# EAGLE schematic breadboard_rev08 (EAGLE 6.1)
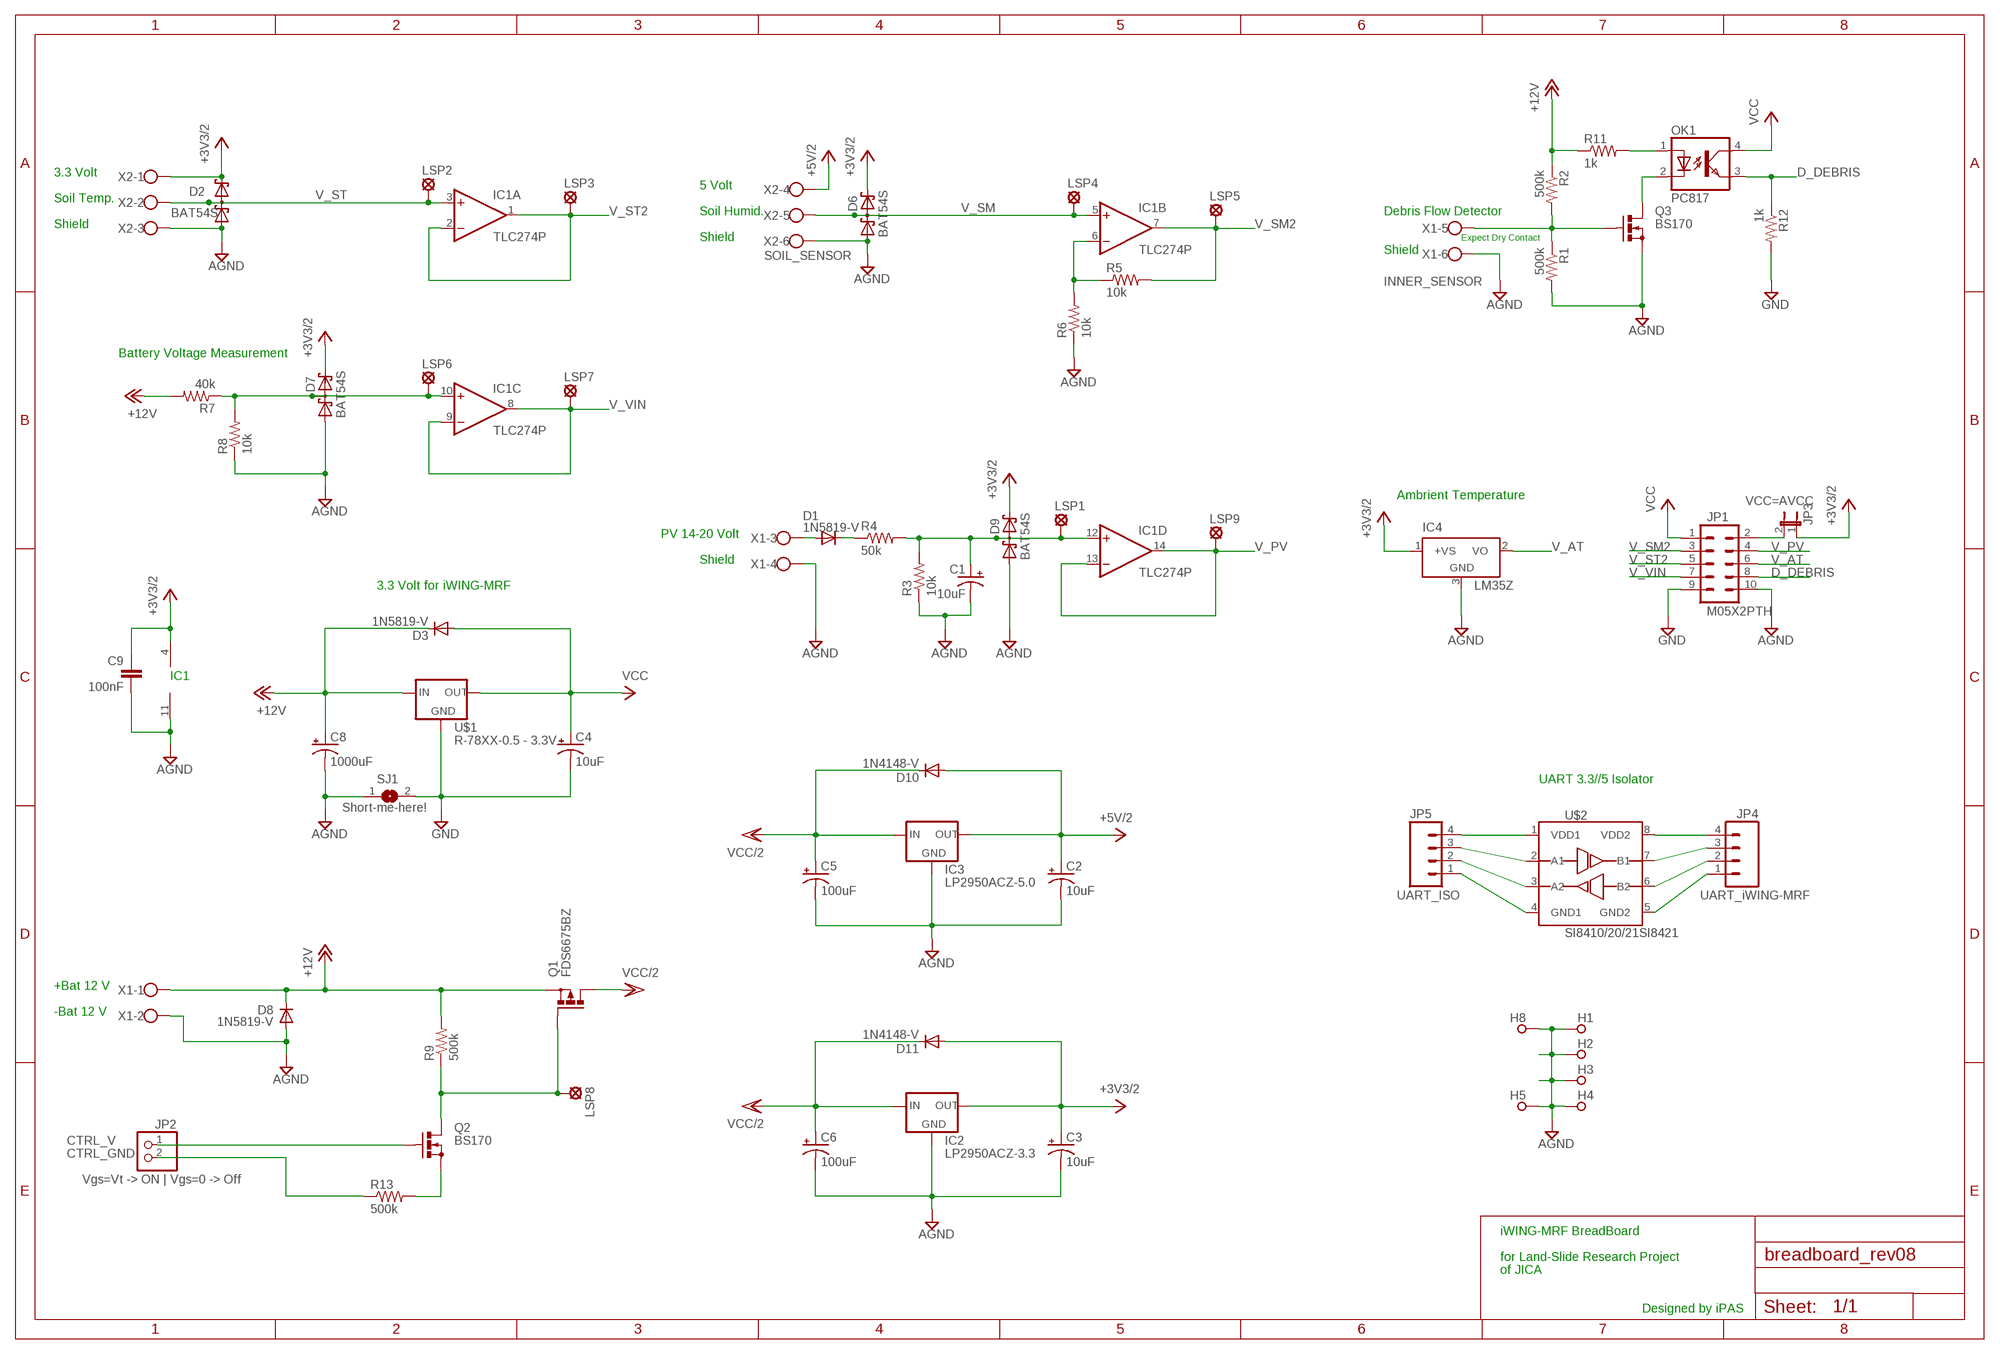
[diagram p0: schematic, sheet 1]

## Parts
C1  10uF  RCL_CPOL-USE2.5-7  [RCL_E2,5-7]
C2  10uF  RCL_CPOL-USE2.5-7  [RCL_E2,5-7]
C3  10uF  RCL_CPOL-USE2.5-7  [RCL_E2,5-7]
C4  10uF  RCL_CPOL-USE2.5-7  [RCL_E2,5-7]
C5  100uF  RCL_CPOL-USE2.5-7  [RCL_E2,5-7]
C6  100uF  RCL_CPOL-USE2.5-7  [RCL_E2,5-7]
C8  1000uF  RCL_CPOL-USE5-13  [RCL_E5-13]
C9  100nF  RCL_C-EU050-025X075  [RCL_C050-025X075]
D1  1N5819-V  [DO41-150V]
D2  BAT54S  [SOT23]
D3  1N5819-V  [DO41-150V]
D6  BAT54S  [SOT23]
D7  BAT54S  [SOT23]
D8  1N5819-V  [DO41-150V]
D9  BAT54S  [SOT23]
D10  1N4148-V  [DO35-100V]
D11  1N4148-V  [DO35-100V]
H1  SPECIAL_DRILL_0.1560  [PAD_0.1560]
H2  SPECIAL_DRILL_0.1560  [PAD_0.1560]
H3  SPECIAL_DRILL_0.1560  [PAD_0.1560]
H4  SPECIAL_DRILL_0.1560  [PAD_0.1560]
H5  SPECIAL_DRILL_0.1560  [PAD_0.1560]
H8  SPECIAL_DRILL_0.1560  [PAD_0.1560]
IC1  TLC274P  [DIL14]
IC2  LP2950ACZ-3.3  [TO92]
IC3  LP2950ACZ-5.0  [TO92]
IC4  LM35Z  [TO92]
JP1  M05X2PTH  [AVR_ICSP]
JP2  Vgs=Vt -> ON | Vgs=0 -> Off  PINHD-1X2  [1X02]
JP3  VCC=AVCC  JP1E  [JUMPER_JP1]
JP4  UART_iWING-MRF  M04POLAR  [MOLEX-1X4]
JP5  UART_ISO  M04POLAR  [MOLEX-1X4]
LSP1  LSP13  [LSP13]
LSP2  LSP13  [LSP13]
LSP3  LSP13  [LSP13]
LSP4  LSP13  [LSP13]
LSP5  LSP13  [LSP13]
LSP6  LSP13  [LSP13]
LSP7  LSP13  [LSP13]
LSP8  LSP13  [LSP13]
LSP9  LSP13  [LSP13]
OK1  PC817  [DIL04]
Q1  FDS6675BZ  P-MOSFET-SO8  [SO-08]
Q2  BS170  [SOT54E]
Q3  BS170  [SOT54E]
R1  500k  RCL_R-US_0204/7  [RCL_0204/7]
R2  500k  RCL_R-US_0204/7  [RCL_0204/7]
R3  10k  RCL_R-US_0204/7  [RCL_0204/7]
R4  50k  RCL_R-US_0204/7  [RCL_0204/7]
R5  10k  RCL_R-US_0204/7  [RCL_0204/7]
R6  10k  RCL_R-US_0204/7  [RCL_0204/7]
R7  40k  RCL_R-US_0204/7  [RCL_0204/7]
R8  10k  RCL_R-US_0204/7  [RCL_0204/7]
R9  500k  RCL_R-US_0204/7  [RCL_0204/7]
R11  1k  RCL_R-US_0204/7  [RCL_0204/7]
R12  1k  RCL_R-US_0204/7  [RCL_0204/7]
R13  500k  RCL_R-US_0204/7  [RCL_0204/7]
SJ1  Short-me-here!  SJ  [SJ]
U$1  R-78XX-0.5 - 3.3V  R-78XX-0.5  [SIP3]
U$2  SI8410/20/21SI8421  [SO-08]
X1  INNER_SENSOR  5EHDRC-6P  [5EHDRC-6P]
X2  SOIL_SENSOR  5EHDRC-6P  [5EHDRC-6P]

## Nets
+3V3/2: C3.+ C9.1 D2.2(C2) D6.2(C2) D7.2(C2) D9.2(C2) D11.A IC1.4(P:V+) IC2.1(OUT) IC4.1(+VS) JP3.1 X2.1
+5V/2: C2.+ D10.A IC3.1(OUT) X2.4
+12V: C8.+ D3.C D8.C Q1.1(S) Q1.2(S) Q1.3(S) R2.1 R7.2 R9.2 R11.1 U$1.1(IN) X1.1
AGND: C1.- C2.- C3.- C5.- C6.- C8.- C9.2 D2.1(A1) D6.1(A1) D7.1(A1) D8.A D9.1(A1) H1.1 H2.1 H3.1 H4.1 H5.1 H8.1 IC1.11(P:V-) IC2.2(GND) IC3.2(GND) IC4.3(GND) JP1.10 Q3.S R1.2 R3.1 R6.1 R8.1 SJ1.1 X1.2 X1.4 X1.6 X2.3 X2.6
CTRL_GND: JP2.2 R13.1
CTRL_V: JP2.1 Q2.G
D_DEBRIS: JP1.8 OK1.3(EMIT) R12.1
GND: C4.- JP1.9 R12.2 SJ1.2 U$1.2(GND)
N$2: D7.3(C1A2) IC1.10(C:+IN) LSP6.MP R7.1 R8.2
N$3: IC1.6(B:-IN) R5.1 R6.2
N$10: LSP8.MP Q1.4(G) Q2.D R9.1
N$13: JP1.2 JP3.2
N$14: OK1.1(A) R11.2
N$15: Q2.S R13.2
N$16: OK1.2(C) Q3.D
N$17: Q3.G R1.1 R2.2 X1.5
N$18: D1.A X1.3
N$19: JP4.4 U$2.8(VDD2)
N$20: D1.C R4.1
N$21: JP4.1 U$2.5(GND2)
N$22: JP5.4 U$2.1(VDD1)
N$23: JP5.3 U$2.2(A1)
N$24: C1.+ D9.3(C1A2) IC1.12(D:+IN) LSP1.MP R3.2 R4.2
N$25: JP5.2 U$2.3(A2)
N$26: JP5.1 U$2.4(GND1)
RX: JP4.3 U$2.7(B1)
TX: JP4.2 U$2.6(B2)
V_AT: IC4.2(VO) JP1.6
V_PV: IC1.13(D:-IN) IC1.14(D:OUT) JP1.4 LSP9.MP
V_SM: D6.3(C1A2) IC1.5(B:+IN) LSP4.MP X2.5
V_SM2: IC1.7(B:OUT) JP1.3 LSP5.MP R5.2
V_ST: D2.3(C1A2) IC1.3(A:+IN) LSP2.MP X2.2
V_ST2: IC1.1(A:OUT) IC1.2(A:-IN) JP1.5 LSP3.MP
V_VIN: IC1.8(C:OUT) IC1.9(C:-IN) JP1.7 LSP7.MP
VCC: C4.+ D3.A JP1.1 OK1.4(COL) U$1.3(OUT)
VCC/2: C5.+ C6.+ D10.C D11.C IC2.3(IN) IC3.3(IN) Q1.5(D) Q1.6(D) Q1.7(D) Q1.8(D)

## Notes on the sheet
- 3.3 Volt
- 5 Volt
- Soil Temp.
- Soil Humid. | Debris Flow Detector
- Shield
- Shield | Expect Dry Contact
- Shield
- Battery Voltage Measurement
- Ambrient Temperature
- PV 14-20 Volt
- Shield
- 3.3 Volt for iWING-MRF
- IC1
- UART 3.3//5 Isolator
- +Bat 12 V
- -Bat 12 V
- iWING-MRF BreadBoard
- for Land-Slide Research Project
- of JICA
- Designed by iPAS

## Library data of the parts
C1-C6 C8 = SDI12IB_v0.5:RCL_CPOL-US: POLARIZED CAPACITOR, American symbol
C9 = ipas:RCL_C-EU: CAPACITOR, European symbol
D1 D3 D8 = ipas:1N5819: DIODE 1N5817 THRU 1N5819 1.0 AMP. Schottky Barrier Rectifiers Features Low forward voltage drop High current capability High reliability High surge current capability
D2 D6 D7 D9 = diode:BAT54S: Schottky Diodes Pin connection corrected 2011-05-04 Source: Fairchild .. BAT54.pdf
D10 D11 = ipas:1N4148: DIODE high speed (Philips)
H1-H5 H8 = ipas:SPECIAL_DRILL_: Special drills
IC1 = linear:TLC274: OP AMP
IC2 IC3 = v-reg:LP2950?*: Source: http://cache.national.com/ds/LP/LP2950.pdf
IC4 = ipas:LM35: Precision Centigrade Temperature Sensors Features Calibrated directly in ̊ Celsius (Centigrade) Linear + 10.0 mV/ ̊C scale factor 0.5 ̊C accuracy guaranteeable (at +25 ̊C) Rated for full −55 ̊ to +150 ̊C range Suitable for remote applications Low cost due to wafer-level trimming Operates from 4 to 30 volts Less than 60 μA current drain Low self-heating, 0.08 ̊C in still air Nonlinearity only ± 1⁄4 ̊C typical Low impedance output, 0.1 Ω for 1 mA load The LM35 series are precision integrated-circuit temperature sensors, whose output voltage is linearly proportional to the Celsius (Centigrade) temperature. The LM35 thus has an advantage over linear temperature sensors calibrated in ̊ Kelvin, as the user is not required to subtract a large constant voltage from its output to obtain convenient Centi- grade scaling. The LM35 does not require any external calibration or trimming to provide typical accuracies of ± 1⁄4 ̊C at room temperature and ± 3⁄4 ̊C over a full −55 to +150 ̊C temperature range. Low cost is assured by trimming and calibration at the wafer level. The LM35’s low output imped- ance, linear output, and precise inherent calibration make interfacing to readout or control circuitry especially easy. It can be used with single power supplies, or with plus and minus supplies. As it draws only 60 μA from its supply, it has very low self-heating, less than 0.1 ̊C in still air. The LM35 is rated to operate over a −55 ̊ to +150 ̊C temperature range, while the LM35C is rated for a −40 ̊ to +110 ̊C range (−10 ̊ with improved accuracy). The LM35 series is available pack- aged in hermetic TO-46 transistor packages, while the LM35C, LM35CA, and LM35D are also available in the plastic TO-92 transistor package. The LM35D is also avail- able in an 8-lead surface mount small outline package and a plastic TO-220 package. Source: http://cache.national.com/ds/LM/LM50.pdf
JP1 = SparkFun-Connectors:M05X2: Header 5x2 Standard 10-pin dual row 0.1" header. Commonly used with AVR-ISP. Use with Spark Fun Electronics SKU: PRT-00778
JP2 = pinhead:PINHD-1X2: PIN HEADER
JP3 = ipas:JP1E: JUMPER
JP4 JP5 = ipas:M04: Header 4 Standard 4-pin 0.1" header. Use with straight break away headers (SKU : PRT-00116), right angle break away headers (PRT-00553), swiss pins (PRT-00743), machine pins (PRT-00117), and female headers (PRT-00115). Molex polarized connector foot print use with SKU : PRT-08231 with associated crimp pins and housings. 1MM SMD Version SKU: PRT-10208
LSP1-LSP9 = solpad:LSP13: SOLDER PAD drill 1.3 mm, distributor Buerklin, 12H562
OK1 = ipas:PC817: SHARP OPTO COUPLER; MPN: PC817X4J000F; OC_FARNELL: 9707727; OC_NEWARK: 97K7059
Q1 = transistor-power:P-MOSFET-SO8: P-Channel MOSFET Example: FDS4435A; P-Channel Logic Level PowerTrench® MOSFET FDS4465; P-Channel 1.8V Specified PowerTrench® MOSFET Source: www.fairchildsemi.com
Q2 Q3 = transistor-small-signal:BS170: N-CHANNEL MOS FET
R1-R9 R11-R13 = SDI12IB_v0.5:RCL_R-US_: RESISTOR, American symbol
SJ1 = jumper:SJ: SMD solder JUMPER
U$1 = ipas:R-78XX-0.5: The R-78xx-Series high efficiency switching regulators are ideally suited to replace 78xx linear regulators and are pin compatible. The efficiency of up to 97% means that very little energy is wasted as heat so there is no need for any heat sinks with their additional space and mounting costs. Low ripple and noise figures and short circuit , overload and over- temperature protection round off the specifications of this versatile converter series.This R-78xx-0.5 is fully certified to EN 60601-1-2 (Medical Equipment), EN 55022 (Emissions), and EN55024 (Immunity) EMC Standards and for EN-60950-1 Safety.
U$2 = ipas:SI8410/20/21: SI8410 / SI8420 / SI8421 ISOPROLOW - POWER SINGLE AND DUAL-CHANNEL DIGITAL ISOLATORS Features High-speed operation Narrow Body SOIC Wide Operating Supply Voltage: isolation 2.70–5.5 V 5 V Operation: 2.70 V Operation: The Silicon Laboratories’ family of ultra low power digital isolators are CMOS devices that employ an RF coupler to transmit digital information across an isolation barrier. Very high speed operation at low power levels is achieved. These devices are available in an 8-pin narrow-body SOIC package. Two speed grade options (1 and 150 Mbps) are available and achieve worst-case propagation delays of less than 10 ns.
X1 X2 = ipas:5EHDRC-6P: Dinkle Headers(Sockets) for pluggable terminal blocks / ECH & EHD series TERMINAL BLOCK, 300V/15A

## Net classes
1 power: width 0.406 mm, clearance 0.203 mm